# Altium schematic sheet semiflex-1.SchDoc
size A3
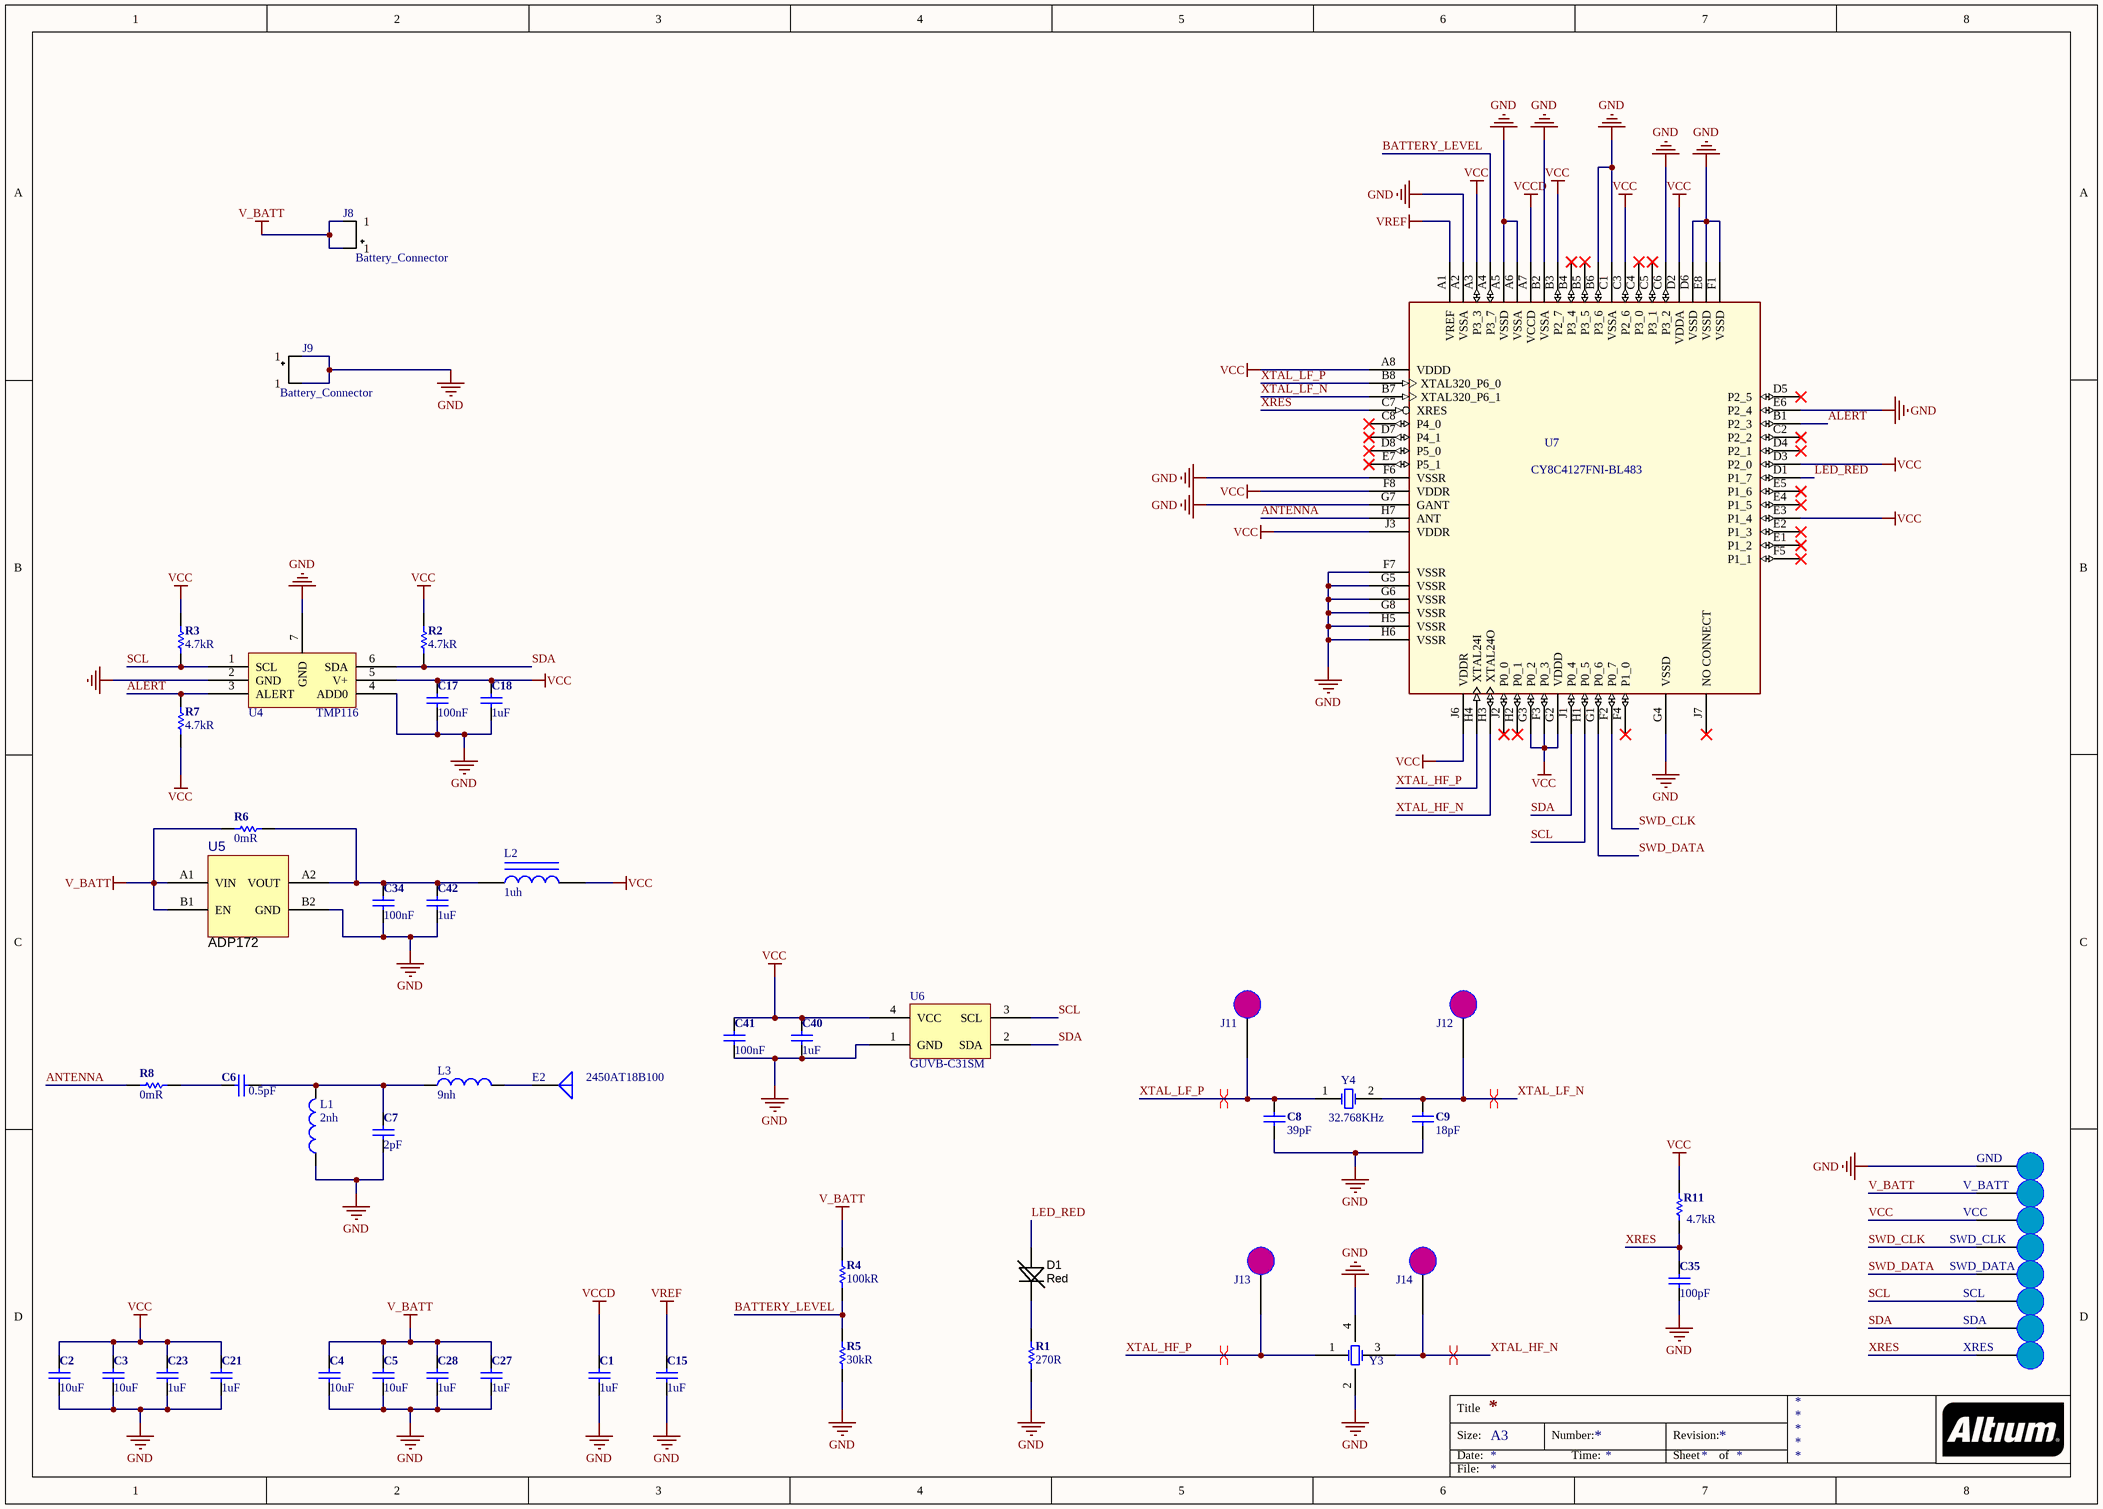
[diagram p0: semiflex-1.SchDoc]

## Parts
C1  1uF  [CAP_0201(0603)_M]
C2  10uF  [CAP_0402(1005)_M]
C3  10uF  [CAP_0402(1005)_M]
C4  10uF  [CAP_0402(1005)_M]
C5  10uF  [CAP_0402(1005)_M]
C6  0.5pF  [CAP_0402(1005)_M]
C7  2pF  [CAP_0402(1005)_M]
C8  39pF  [CAP_0402(1005)_M]
C9  18pF  [CAP_0402(1005)_M]
C15  1uF  [CAP_0201(0603)_M]
C17  100nF  [CAP_0201(0603)_M]
C18  1uF  [CAP_0201(0603)_M]
C21  1uF  [CAP_0201(0603)_M]
C23  1uF  [CAP_0201(0603)_M]
C27  1uF  [CAP_0201(0603)_M]
C28  1uF  [CAP_0201(0603)_M]
C34  100nF  [CAP_0201(0603)_M]
C35  100pF  [CAP_0201(0603)_M]
C40  1uF  [CAP_0201(0603)_M]
C41  100nF  [CAP_0201(0603)_M]
C42  1uF  [CAP_0201(0603)_M]
D1  Red  [LED_0402(1005)]
E2  2450AT18B100  [2450AT18B100]
GND  Probe-Pin Pad  [Pogo-Pin-Pad]  (value not drawn)
J8  Battery_Connector  [Battery_PAD]
J9  Battery_Connector  [Battery_PAD]
J11  Probe-CLOCK  [Pogo-CLOCK-PAD]  (value not drawn)
J12  Probe-CLOCK  [Pogo-CLOCK-PAD]  (value not drawn)
J13  Probe-CLOCK  [Pogo-CLOCK-PAD]  (value not drawn)
J14  Probe-CLOCK  [Pogo-CLOCK-PAD]  (value not drawn)
L1  2nh  [IND_0402(1005)_M]
L2  1uh  [IND_0402(1005)_M]
L3  9nh  [IND_0402(1005)_M]
R1  270R  [RES_0201(0603)_M]
R2  4.7kR  [RES_0201(0603)_M]
R3  4.7kR  [RES_0201(0603)_M]
R4  100kR  [RES_0201(0603)_M]
R5  30kR  [RES_0201(0603)_M]
R6  0mR  [RES_0402(1005)_M]
R7  4.7kR  [RES_0201(0603)_M]
R8  0mR  [RES_0402(1005)_M]
R11  4.7kR  [RES_0201(0603)_M]
SCL  Probe-Pin Pad  [Pogo-Pin-Pad]  (value not drawn)
SDA  Probe-Pin Pad  [Pogo-Pin-Pad]  (value not drawn)
SWD_CLK  Probe-Pin Pad  [Pogo-Pin-Pad]  (value not drawn)
SWD_DATA  Probe-Pin Pad  [Pogo-Pin-Pad]  (value not drawn)
U4  TMP116  [WSON-6]
U5  ADP172  [ADP172]
U6  GUVB-C31SM  [GUVB-C31SM]
U7  CY8C4127FNI-BL483  [WLCSP-68_MOD]
V_BATT  Probe-Pin Pad  [Pogo-Pin-Pad]  (value not drawn)
VCC  Probe-Pin Pad  [Pogo-Pin-Pad]  (value not drawn)
XRES  Probe-Pin Pad  [Pogo-Pin-Pad]  (value not drawn)
Y3  ECX-2236  [ECX-2236]  (value not drawn)
Y4  32.768KHz  [ABS05]

## Nets
GND: C1.2 C2.2 C3.2 C4.2 C5.2 C7.2 C8.2 C9.2 C15.2 C17.2 C18.2 C21.2 C23.2 C27.2 C28.2 C34.2 C35.2 C40.1 C41.1 C42.2 GND.1 J9.1 L1.1 R1.2 R5.2 U4.2(GND) U4.4(ADD0) U4.7(GND) U5.B2(GND) U6.1(GND) U7.A2(VSSA) U7.A5(VSSD) U7.A6(VSSA) U7.B2(VSSA) U7.B6(P3_6) U7.C1(VSSA) U7.C6(P3_2) U7.D6(VSSD) U7.E6(P2_4) U7.E8(VSSD) U7.F1(VSSD) U7.F6(VSSR) U7.F7(VSSR) U7.G4(VSSD) U7.G5(VSSR) U7.G6(VSSR) U7.G7(GANT) U7.G8(VSSR) U7.H5(VSSR) U7.H6(VSSR) Y3.2(GND) Y3.4(GND)
V_BATT: C4.1 C5.1 C27.1 C28.1 J8.1 R4.1 R6.1 U5.A1(VIN) U5.B1(EN) V_BATT.1
VCC: C2.1 C3.1 C17.1 C18.1 C21.1 C23.1 C40.2 C41.2 L2.2 R2.1 R3.1 R7.2 R11.1 U4.5(V+) U6.4(VCC) U7.A3(P3_3) U7.A8(VDDD) U7.B3(P2_7) U7.C3(P2_6) U7.D2(VDDA) U7.D3(P2_0) U7.E3(P1_4) U7.F3(P0_3) U7.F8(VDDR) U7.G2(VDDD) U7.G3(P0_2) U7.J3(VDDR) U7.J6(VDDR) VCC.1
VCCD: C1.1 U7.A7(VCCD)
VREF: C15.1 U7.A1(VREF)
ALERT: R7.1 U4.3(ALERT) U7.B1(P2_3)
ANTENNA: R8.1 U7.H7(ANT)
BATTERY_LEVEL: R4.2 R5.1 U7.A4(P3_7)
LED_RED: D1.A U7.D1(P1_7)
SCL: R3.2 SCL.1 U4.1(SCL) U6.3(SCL) U7.H1(P0_5)
SDA: R2.2 SDA.1 U4.6(SDA) U6.2(SDA) U7.J1(P0_4)
SWD_CLK: SWD_CLK.1 U7.F2(P0_7)
SWD_DATA: SWD_DATA.1 U7.G1(P0_6)
XRES: C35.1 R11.2 U7.C7(XRES) XRES.1
XTAL_HF_N: J14.1 U7.H3(XTAL24O) Y3.3(OSC2)
XTAL_HF_P: J13.1 U7.H4(XTAL24I) Y3.1(OSC1)
XTAL_LF_N: C9.1 J12.1 U7.B7(XTAL320_P6_1) Y4.2(OSC2)
XTAL_LF_P: C8.1 J11.1 U7.B8(XTAL320_P6_0) Y4.1(OSC1)
NetC6_1: C6.1 R8.2
NetC6_2: C6.2 C7.1 L1.2 L3.1
NetC34_1: C34.1 C42.1 L2.1 R6.2 U5.A2(VOUT)
NetD1_K: D1.K R1.1
NetE2_1: E2.1(A) L3.2

Not connected (* = marked no-connect by the designer): U7 B4(P3_4)* B5(P3_5)* C2(P2_2)* C4(P3_0)* C5(P3_1)* C8(P4_0)* D4(P2_1)* D5(P2_5)* D7(P4_1)* D8(P5_0)* E1(P1_2)* E2(P1_3)* E4(P1_5)* E5(P1_6)* E7(P5_1)* F4(P1_0)* F5(P1_1)* H2(P0_1)* J2(P0_0)* J7(NO_CONNECT)*

## Layout directives
differential pair: XTAL_HF_N, XTAL_HF_P, XTAL_LF_N, XTAL_LF_P

## Notes on the sheet
- Title
- Size:
- Date:
- A3
- Number:
- Time:
- Revision:
- Sheet
- of
- File:

## Library data of the parts
C1 C15 C18 C21 C23 C27 C28 C40 C42 = C-0201(0603): ___ OHM ___ mW 0201(0603) SMD; Manufacturer: Murata; Manufacturer Part Number: GRM033C81A105ME05D; Description 1: 1µF 10V Ceramic Capacitor X6S 0201 (0603 Metric) 0.024" L x 0.012" W (0.60mm x 0.30mm); Voltage Rating: 10V; Tolerance: 20%; Dielectric: X6S; Supplier 1: Digi-Key; Supplier Part Number 1: 490-13219-1-ND; Stock 1: 1199738; Pricing 1: 1=0.48, 10=0.333, 100=0.1997, 500=0.1498, 1000=0.1265, 2500=0.1198, 5000=0.1132 (USD); Mount: Surface Mount; Case/Package: 0201; Case Code (Metric): 0603; Case Code (Imperial): 0201; Min Operating Temperature: -55°C; Max Operating Temperature: 105°C; Packaging: Tape and Reel; Capacitance: 1uF; Voltage Rating (DC): 10V; Length: 0.024inch; Width: 0.012inch; Thickness: 0.015inch; ComponentLink1URL: http://search.murata.co.jp/Ceramy/image/img/A01X/partnumbering_e_01.pdf; ComponentLink1Description: http://search.murata.co.jp/Ceramy/image/img/A01X/partnumbering_e_01.pdf
C2-C5 = C-0402(1005): ___ OHM ___ mW 0402(1005) SMD; Manufacturer: Murata; Manufacturer Part Number: GRM155R60J106ME15D; Description 1: 10µF 6.3V Ceramic Capacitor X5R 0402 (1005 Metric) 0.039" L x 0.020" W (1.00mm x 0.50mm); Voltage Rating: 6.3V; Tolerance: 20%; Dielectric: X5R; Supplier 1: Digi-Key; Supplier Part Number 1: 490-13238-1-ND; Stock 1: 427251; Pricing 1: 1=0.29, 10=0.196, 100=0.0994, 500=0.068, 1000=0.0602, 2500=0.0576, 5000=0.0523 (USD); Mount: Surface Mount; Case/Package: 0402; Case Code (Metric): 1005; Case Code (Imperial): 0402; Min Operating Temperature: -55°C; Max Operating Temperature: 85°C; Packaging: Tape and Reel; Capacitance: 10uF; Voltage Rating (DC): 6.3V; Length: 0.039inch; Width: 0.02inch; Thickness: 0.026inch; ComponentLink1URL: http://search.murata.co.jp/Ceramy/image/img/A01X/partnumbering_e_01.pdf; ComponentLink1Description: http://search.murata.co.jp/Ceramy/image/img/A01X/partnumbering_e_01.pdf
C6 = C-0402(1005): ___ OHM ___ mW 0402(1005) SMD; Manufacturer: Murata; Manufacturer Part Number: GJM1555C1HR50WB01D; Description 1: Multilayer Ceramic Capacitors MLCC - SMD/SMT 0402 0.5pF 50Volts C0G +/-0.05pF; Voltage Rating: 50V; Dielectric: C0G; Supplier 1: Digi-Key; Supplier Part Number 1: 490-11250-1-ND; Stock 1: 57275; Pricing 1: 1=0.3, 10=0.205, 100=0.1161, 500=0.082, 1000=0.0717, 2500=0.0683, 5000=0.0632 (USD); Mount: Surface Mount; Case/Package: 0402; Case Code (Metric): 1005; Case Code (Imperial): 0402; Min Operating Temperature: -55°C; Max Operating Temperature: 125°C; Package Quantity: 10000; Capacitance: 0.5pF; Packaging: Tape and Reel; Voltage Rating (DC): 50V; Termination: SMD/SMT; Voltage: 50V; Length: 1mm; Height: 0.5mm; Width: 0.02inch; Thickness: 0.022inch; Depth: 0.5mm; Radiation Hardening: No; Lead Free: Lead Free; ComponentLink1URL: https://datasheet.ciiva.com/169/product-169683.pdf; ComponentLink1Description: https://datasheet.ciiva.com/169/product-169683.pdf
C7 = C-0402(1005): ___ OHM ___ mW 0402(1005) SMD; Manufacturer: Murata; Manufacturer Part Number: GJM1555C1H2R0BB01D; Description 1: Multilayer Ceramic Capacitors MLCC - SMD/SMT 0402 2.0pF 50Volts C0G +/-0.1pF; Voltage Rating: 50V; Dielectric: C0G; Supplier 1: Digi-Key; Supplier Part Number 1: 490-8091-1-ND; Stock 1: 103779; Pricing 1: 1=0.19, 10=0.13, 100=0.0659, 500=0.0451, 1000=0.0399, 2500=0.0381, 5000=0.0347 (USD); Mount: Surface Mount; Case/Package: 0402; Number of Pins: 2; Case Code (Metric): 1005; Case Code (Imperial): 0402; Min Operating Temperature: -55°C; Max Operating Temperature: 125°C; Package Quantity: 1; Packaging: Tape and Reel; Capacitance: 2pF; Voltage Rating (DC): 50V; Termination: SMD/SMT; Length: 1mm; Height: 0.5mm; Width: 0.5mm; Thickness: 0.022inch; Lead Pitch: 0.3mm; Depth: 0.5mm; Radiation Hardening: No; REACH SVHC: No SVHC; Lead Free: Lead Free; ComponentLink1URL: https://datasheet.ciiva.com/5694/1700193-5694978.pdf; ComponentLink1Description: https://datasheet.ciiva.com/5694/1700193-5694978.pdf; ComponentLink2URL: https://datasheet.ciiva.com/16440/l0005e-16440476.pdf; ComponentLink2Description: https://datasheet.ciiva.com/16440/l0005e-16440476.pdf; ComponentLink3URL: https://datasheet.ciiva.com/17453/product-17453487.pdf; ComponentLink3Description: https://datasheet.ciiva.com/17453/product-17453487.pdf
C8 = C-0402(1005): ___ OHM ___ mW 0402(1005) SMD; Manufacturer: KEMET; Manufacturer Part Number: CBR04C390F5GAC; Description 1: Multilayer Ceramic Capacitors MLCC - SMD/SMT 39pF 50volts 1%; Dielectric: C0G; Voltage Rating (DC): 50V; Tolerance: 1%; Supplier 1: Digi-Key; Supplier Part Number 1: 399-16083-1-ND; Stock 1: 6320; Pricing 1: 1=0.54, 10=0.374, 100=0.2247, 500=0.1685, 1000=0.1423, 2500=0.1348, 5000=0.1273 (USD); Case/Package: 0402; Weight: 2.3E-05oz; Case Code (Imperial): 0402; Case Code (Metric): 1005; Min Operating Temperature: -55°C; Max Operating Temperature: 125°C; Capacitance: 39pF; Packaging: Tape and Reel; Termination: SMD/SMT; Package Quantity: 10000; Length: 1mm; Height: 0.5mm; Width: 0.5mm; ComponentLink1URL: http://www.mouser.com/ds/2/212/KEM_C1030_CBR_SMD-346920.pdf; ComponentLink1Description: http://www.mouser.com/ds/2/212/KEM_C1030_CBR_SMD-346920.pdf
C9 = C-0402(1005): ___ OHM ___ mW 0402(1005) SMD; Manufacturer: Murata; Manufacturer Part Number: GJM1555C1H180FB01D; Description 1: Multilayer Ceramic Capacitors MLCC - SMD/SMT 0402 18pF 50Volts C0G 1%; Tolerance: 1%; Voltage Rating: 50V; Dielectric: C0G; Supplier 1: Digi-Key; Supplier Part Number 1: 490-11192-1-ND; Stock 1: 51032; Pricing 1: 1=0.24, 10=0.162, 100=0.0822, 500=0.0563, 1000=0.0498, 2500=0.0476, 5000=0.0433 (USD); Mount: Surface Mount; Case/Package: 0402; Case Code (Imperial): 0402; Case Code (Metric): 1005; Min Operating Temperature: -55°C; Max Operating Temperature: 125°C; Capacitance: 18pF; Package Quantity: 10000; Packaging: Tape and Reel; Voltage Rating (DC): 50V; Termination: SMD/SMT; Length: 1mm; Height: 0.5mm; Width: 0.02inch; Thickness: 0.022inch; Depth: 0.5mm; Radiation Hardening: No; Lead Free: Lead Free; ComponentLink1URL: https://datasheet.ciiva.com/11607/c02e-11607834.pdf; ComponentLink1Description: https://datasheet.ciiva.com/11607/c02e-11607834.pdf
C17 C34 C41 = C-0201(0603): ___ OHM ___ mW 0201(0603) SMD; Manufacturer: Murata; Manufacturer Part Number: GRM033R61A104ME15D; Description 1: Cap Ceramic 0.1uF 10V X5R 20% SMD 0201 85C Paper T/R; Voltage Rating: 10V; Tolerance: 20%; Dielectric: X5R; Supplier 1: Digi-Key; Supplier Part Number 1: 490-5405-1-ND; Stock 1: 5696; Pricing 1: 1=0.1, 10=0.021, 100=0.0092, 500=0.0066, 1000=0.0052, 2500=0.0047, 5000=0.0043 (USD); Mount: Surface Mount; Case/Package: 0201; Case Code (Metric): 0603; Case Code (Imperial): 0201; Min Operating Temperature: -55°C; Max Operating Temperature: 85°C; Capacitance: 100nF; Packaging: Tape and Reel; Package Quantity: 10; Voltage Rating (DC): 10V; Length: 0.024inch; Width: 0.012inch; Thickness: 0.013inch; Depth: 0.3mm; Lead Free: Lead Free; ComponentLink1URL: https://datasheet.ciiva.com/131/partnumbering-e-01-131478.pdf; ComponentLink1Description: https://datasheet.ciiva.com/131/partnumbering-e-01-131478.pdf; ComponentLink2URL: https://datasheet.ciiva.com/131/partnumbering-e-01-131479.pdf; ComponentLink2Description: https://datasheet.ciiva.com/131/partnumbering-e-01-131479.pdf
C35 = C-0201(0603): ___ OHM ___ mW 0201(0603) SMD; Manufacturer: Murata; Manufacturer Part Number: GRM033R71C101KA01D; Description 1: Multilayer Ceramic Capacitors MLCC - SMD/SMT 100pF 16 volts 10%; Voltage Rating: 16V; Tolerance: 10%; Dielectric: X7R; Supplier 1: Digi-Key; Supplier Part Number 1: 490-6146-1-ND; Stock 1: 195000; Pricing 1: 1=0.1, 10=0.033, 100=0.0148, 500=0.0106, 1000=0.0083, 2500=0.0076, 5000=0.007 (USD); Mount: Surface Mount; Case/Package: 0201; Case Code (Metric): 0603; Case Code (Imperial): 0201; Min Operating Temperature: -55°C; Max Operating Temperature: 125°C; Capacitance: 100pF; Packaging: Tape and Reel; Voltage Rating (DC): 16V; Package Quantity: 15000; Termination: SMD/SMT; Length: 0.6mm; Height: 0.3mm; Width: 0.012inch; Thickness: 0.013inch; Depth: 0.3mm; Radiation Hardening: No; Lead Free: Lead Free; ComponentLink1URL: https://datasheet.ciiva.com/11605/product-11605537.pdf; ComponentLink1Description: https://datasheet.ciiva.com/11605/product-11605537.pdf; ComponentLink2URL: https://datasheet.ciiva.com/6263/partnumbering-e-01-6263654.pdf; ComponentLink2Description: https://datasheet.ciiva.com/6263/partnumbering-e-01-6263654.pdf; ComponentLink3URL: https://datasheet.ciiva.com/6263/partnumbering-e-01-6263658.pdf; ComponentLink3Description: https://datasheet.ciiva.com/6263/partnumbering-e-01-6263658.pdf; ComponentLink4URL: https://datasheet.ciiva.com/18184/getdatasheetpartid-254442-18184076.pdf; ComponentLink4Description: https://datasheet.ciiva.com/18184/getdatasheetpartid-254442-18184076.pdf
D1 = LED_0402(1005): LED, 0402(1005) SMD; Manufacturer: Kingbright; Manufacturer Part Number: APHHS1005SURCK; Description 1: LED 1X0.5MM 630NM RD WTR CLR SMD; Lens Colour: Clear; Forward Current: 20mA; Forward Voltage: 1.95V; Luminous Intensity: 220mcd; Viewing Angle: 120°; Wavelength: 635nm; Lens Style: Flat,Clear; Dominant Wavelength: 630nm; Number of LEDs: 1; Supplier 1: Digi-Key; Supplier Part Number 1: 754-1104-1-ND; Stock 1: 195639; Pricing 1: 1=0.44, 10=0.318, 25=0.2596, 100=0.2077, 250=0.1752, 500=0.1493, 1000=0.1168 (USD); Mount: Surface Mount; Case/Package: 0402; Number of Pins: 2; Colour: Red; Case Code (Metric): 1005; Case Code (Imperial): 0402; Min Operating Temperature: -40°C; Max Operating Temperature: 85°C; Packaging: Tape and Reel; Package Quantity: 2000; Illumination Colour: Red; Test Current: 20mA; Length: 1mm; Height: 0.6mm; Width: 0.5mm; Lead Free: Lead Free; ComponentLink1URL: https://datasheet.ciiva.com/14603/70062833-14603899.pdf; ComponentLink1Description: https://datasheet.ciiva.com/14603/70062833-14603899.pdf; ComponentLink2URL: https://datasheet.ciiva.com/2114/aphhs1005surck-2114140.pdf; ComponentLink2Description: https://datasheet.ciiva.com/2114/aphhs1005surck-2114140.pdf; ComponentLink3URL: https://datasheet.ciiva.com/4689/aphhs1005surck-32322-4689068.pdf; ComponentLink3Description: https://datasheet.ciiva.com/4689/aphhs1005surck-32322-4689068.pdf; ComponentLink4URL: https://datasheet.ciiva.com/2114/aphhs1005surck-2114141.pdf; ComponentLink4Description: https://datasheet.ciiva.com/2114/aphhs1005surck-2114141.pdf; ComponentLink5URL: https://datasheet.ciiva.com/2114/aphhs1005surck-2114142.pdf; ComponentLink5Description: https://datasheet.ciiva.com/2114/aphhs1005surck-2114142.pdf
E2 = 2450AT18B100: 2.4 GHz BLE Antenna; Manufacturer: Johanson; Manufacturer Part Number: 2450AT18B100E; Description 1: JOHANSON TECHNOLOGY         2450AT18B100E             ANTENNA, CERAMIC, 2.45GHZ; Impedance: 50R; Bandwidth: 100MHz; Power Rating: 3W; Frequency: 2.45GHz; Number of Bands: 1; Return Loss: -9.5dB; Max Frequency: 2.5GHz; Gain: -0.5dB; Supplier 1: Digi-Key; Supplier Part Number 1: 712-1006-1-ND; Stock 1: 187598; Pricing 1: 1=0.62, 10=0.541, 25=0.4788, 100=0.4172, 250=0.3631, 500=0.309, 1000=0.2472 (USD); Mount: Surface Mount; Case/Package: CSMD; Contact Plating: Tin; Packaging: Tape and Reel; Package Quantity: 1; Max Power Dissipation: 3W; Termination: Solder; Length: 3.2mm; Height: 0.051inch; Width: 1.6mm; REACH SVHC: No SVHC; ComponentLink1URL: https://datasheet.ciiva.com/1124/1318299-1124918.pdf; ComponentLink1Description: https://datasheet.ciiva.com/1124/1318299-1124918.pdf; ComponentLink2URL: https://datasheet.ciiva.com/24025/antenna-2450at18b100-242422-24025839.pdf; ComponentLink2Description: https://datasheet.ciiva.com/24025/antenna-2450at18b100-242422-24025839.pdf
L1 = I-0402(1005): Manufacturer: Abracon; Manufacturer Part Number: AISC-0402-2N0J-T; Description 1: 2nH Unshielded Wirewound Inductor 1.04A 70 mOhm Max 0402 (1005 Metric); Core Material: Ceramic; Current Rating: 1.04A; Tolerance: 5%; Shielding: Unshielded; Q Factor: 16; Self Resonant Frequency: 11.1GHz; DC Resistance (DCR): 70mR; Test Frequency: 250MHz; Supplier 1: Digi-Key; Supplier Part Number 1: 535-10424-6-ND; Stock 1: 5165; Pricing 1: 1=0.33, 10=0.297, 25=0.264, 50=0.231, 100=0.2145, 500=0.1881, 750=0.1716, 1000=0.1518 (USD); Mount: Surface Mount; Case/Package: 0402; Number of Pins: 2; Case Code (Metric): 1005; Case Code (Imperial): 0402; Min Operating Temperature: -40°C; Max Operating Temperature: 125°C; Package Quantity: 10000; Packaging: Tape and Reel; Composition: Wirewound,Ceramic; Inductance: 2nh; Max DC Current: 1.04A; Termination: SMD/SMT; DC Current: 1.04A; Military Standard: Not; Length: 1.19mm; Height: 0.66mm; Width: 0.025inch; Height - Seated (Max): 0.026inch; Depth: 0.64mm; Radiation Hardening: No; ComponentLink1URL: https://datasheet.ciiva.com/1054/aisc-0402-1054032.pdf; ComponentLink1Description: https://datasheet.ciiva.com/1054/aisc-0402-1054032.pdf; ComponentLink2URL: https://datasheet.ciiva.com/26928/getdatasheetpartid-762366-26928064.pdf; ComponentLink2Description: https://datasheet.ciiva.com/26928/getdatasheetpartid-762366-26928064.pdf; ComponentLink3URL: https://datasheet.ciiva.com/11140/aisc-0402-11140262.pdf; ComponentLink3Description: https://datasheet.ciiva.com/11140/aisc-0402-11140262.pdf; ComponentLink4URL: https://datasheet.ciiva.com/1054/aisc-0402-1054030.pdf; ComponentLink4Description: https://datasheet.ciiva.com/1054/aisc-0402-1054030.pdf; ComponentLink5URL: https://datasheet.ciiva.com/1054/aisc-0402-1054031.pdf; ComponentLink5Description: https://datasheet.ciiva.com/1054/aisc-0402-1054031.pdf
L2 = Inductor Iron: Magnetic-Core Inductor; Manufacturer: TDK; Manufacturer Part Number: MLZ1005M1R0WT000; Description 1: FIXED IND 1UH 450MA 350 MOHM SMD; Core Material: Ferrite; Tolerance: 20%; Current Rating: 450mA; Saturation Current: 100mA; Shielding: Shielded; DC Resistance (DCR): 455mR; Self Resonant Frequency: 170MHz; Test Frequency: 2MHz; Supplier 1: Digi-Key; Supplier Part Number 1: 445-6379-1-ND; Stock 1: 22743; Pricing 1: 1=0.29, 10=0.258, 100=0.1771, 500=0.1513, 1000=0.1159, 2500=0.1095 (USD); Mount: Surface Mount; Case/Package: 0402; Case Code (Metric): 1005; Case Code (Imperial): 0402; Min Operating Temperature: -55°C; Max Operating Temperature: 125°C; Package Quantity: 10000; Packaging: Tape and Reel; Inductance: 1uh; Length: 0.039inch; Width: 0.02inch; Height - Seated (Max): 0.022inch; ComponentLink1URL: https://datasheet.ciiva.com/29699/inductor-commercial-decoupling-mlz-en-29699052.pdf; ComponentLink1Description: https://datasheet.ciiva.com/29699/inductor-commercial-decoupling-mlz-en-29699052.pdf; ComponentLink2URL: https://datasheet.ciiva.com/29699/inductor-commercial-decoupling-mlz-en-29699053.pdf; ComponentLink2Description: https://datasheet.ciiva.com/29699/inductor-commercial-decoupling-mlz-en-29699053.pdf
L3 = I-0402(1005): Manufacturer: Murata; Manufacturer Part Number: LQW15AN9N0G80D; Description 1: 9nH Unshielded Wirewound Inductor 1.42A 70 mOhm Max 0402 (1005 Metric); Current Rating: 1.42A; Shielding: Unshielded; DC Resistance (DCR): 70mR; Self Resonant Frequency: 6.5GHz; Test Frequency: 100MHz; Tolerance: 2%; Supplier 1: Digi-Key; Supplier Part Number 1: 490-14715-1-ND; Stock 1: 3213; Pricing 1: 1=0.25, 10=0.221, 100=0.1518, 500=0.1297, 1000=0.0994, 2500=0.0938 (USD); Mount: Surface Mount; Case/Package: 0402; Min Operating Temperature: -55°C; Max Operating Temperature: 125°C; Packaging: Tape and Reel; Composition: Wirewound; Inductance: 9nh; Length: 0.039inch; Width: 0.024inch; Height - Seated (Max): 0.024inch
R1 = R-0201(0603): ___ OHM ___ mW 0201(0603) SMD; Manufacturer: Yageo; Manufacturer Part Number: RC0201JR-07270RL; Description 1: Res Thick Film 0201 270 Ohm 5% 0.05W(1/20W) ±200ppm/C Molded SMD Paper T/R; Tolerance: 5%; Power Rating: 50mW; Temperature Coefficient: 200ppm/°C; Supplier 1: Digi-Key; Supplier Part Number 1: 311-270NCT-ND; Stock 1: 26098; Pricing 1: 1=0.1, 10=0.043, 100=0.0174, 1000=0.0078, 2500=0.0068, 5000=0.0056 (USD); Case/Package: 0201; Contact Plating: Tin,Matte; Min Operating Temperature: -55°C; Max Operating Temperature: 125°C; Resistance: 270R; Packaging: Tape and Reel; Composition: Thick Film; Military Standard: Not; Length: 0.6mm; Depth: 0.3mm; Radiation Hardening: No; Lead Free: Lead Free; ComponentLink1URL: https://datasheet.ciiva.com/16855/pyu-rc0201-51-rohs-l-8-16855339.pdf; ComponentLink1Description: https://datasheet.ciiva.com/16855/pyu-rc0201-51-rohs-l-8-16855339.pdf; ComponentLink2URL: https://datasheet.ciiva.com/28392/pyu-rc0201-51-rohs-l-8-28392445.pdf; ComponentLink2Description: https://datasheet.ciiva.com/28392/pyu-rc0201-51-rohs-l-8-28392445.pdf
R2 R3 R7 R11 = R-0201(0603): ___ OHM ___ mW 0201(0603) SMD; Manufacturer: Samsung; Manufacturer Part Number: RC0603F472CS; Description 1: RES SMD 4.7K OHM 1% 1/20W 0201; Tolerance: 1%; Max Power Dissipation: 50mW; Temperature Coefficient: 250ppm/°C; Voltage Rating (DC): 25V; Supplier 1: Digi-Key; Supplier Part Number 1: 1276-3651-1-ND; Stock 1: 51051; Pricing 1: 1=0.1, 10=0.021, 100=0.0086, 1000=0.0039, 2500=0.0033, 5000=0.0028 (USD); Case/Package: 0201; Case Code (Metric): 0603; Case Code (Imperial): 0201; Contact Plating: Tin; Min Operating Temperature: -55°C; Max Operating Temperature: 125°C; Packaging: Tape and Reel; Resistance: 4.7kR; Composition: Thick Film; Package Quantity: 1; Number of Terminations: 2; Length: 0.024inch; Height: 0.01inch; Width: 0.012inch; Radiation Hardening: No; Lead Free: Lead Free; ComponentLink1URL: http://components.arrow.com/part/dataview/52317213S9968065N4139; ComponentLink1Description: http://components.arrow.com/part/dataview/52317213S9968065N4139; ComponentLink2URL: http://www.samsungsem.com/kr/support/library/product-catalog/__icsFiles/afieldfile/2015/09/22/CHIP_RESISTOR_2015.pdf; ComponentLink2Description: http://www.samsungsem.com/kr/support/library/product-catalog/__icsFiles/afieldfile/2015/09/22/CHIP_RESISTOR_2015.pdf; ComponentLink3URL: http://www.samsungsem.com/servlet/FileDownload?type=spec&file=RC0603F100CS.pdf; ComponentLink3Description: http://www.samsungsem.com/servlet/FileDownload?type=spec&file=RC0603F100CS.pdf
R4 = R-0201(0603): ___ OHM ___ mW 0201(0603) SMD; Manufacturer: Yageo; Manufacturer Part Number: RC0201FR-07100KL; Description 1: RES SMD 100K OHM 1% 1/20W 0201; Tolerance: 1%; Power Rating: 50mW; Voltage Rating: 25V; Temperature Coefficient: 200ppm/°C; Supplier 1: Digi-Key; Supplier Part Number 1: 311-100KMDKR-ND; Stock 1: 5575803; Pricing 1: 1=0.1, 10=0.057, 100=0.0232, 1000=0.0104, 2500=0.009, 5000=0.0075 (USD); Case/Package: 0201; Number of Pins: 2; Case Code (Imperial): 0201; Case Code (Metric): 0603; Contact Plating: Tin,Matte; Min Operating Temperature: -55°C; Max Operating Temperature: 125°C; Resistance: 100kR; Packaging: Tape and Reel; Package Quantity: 10000; Termination: SMD/SMT; Composition: Thick Film; Number of Terminations: 2; Military Standard: Not; Max Power Dissipation: 50mW; Voltage Rating (DC): 25V; Length: 0.024inch; Height: 0.01inch; Width: 0.012inch; Depth: 0.3mm; REACH SVHC: No SVHC; Lead Free: Lead Free; ComponentLink1URL: https://datasheet.ciiva.com/7660/1421516-7660806.pdf; ComponentLink1Description: https://datasheet.ciiva.com/7660/1421516-7660806.pdf; ComponentLink2URL: https://datasheet.ciiva.com/2493/pyu-r-int-thick-7-2493769.pdf; ComponentLink2Description: https://datasheet.ciiva.com/2493/pyu-r-int-thick-7-2493769.pdf; ComponentLink3URL: https://datasheet.ciiva.com/2493/pyu-r-int-thick-7-2493770.pdf; ComponentLink3Description: https://datasheet.ciiva.com/2493/pyu-r-int-thick-7-2493770.pdf; ComponentLink4URL: https://datasheet.ciiva.com/26829/getdatasheetpartid-420441-26829850.pdf; ComponentLink4Description: https://datasheet.ciiva.com/26829/getdatasheetpartid-420441-26829850.pdf; ComponentLink5URL: https://datasheet.ciiva.com/46391/1421516-46391338.pdf; ComponentLink5Description: https://datasheet.ciiva.com/46391/1421516-46391338.pdf; ComponentLink6URL: https://datasheet.ciiva.com/2493/pyu-r-int-thick-7-2493771.pdf; ComponentLink6Description: https://datasheet.ciiva.com/2493/pyu-r-int-thick-7-2493771.pdf; ComponentLink7URL: https://datasheet.ciiva.com/16855/pyu-rc0201-51-rohs-l-8-16855774.pdf; ComponentLink7Description: https://datasheet.ciiva.com/16855/pyu-rc0201-51-rohs-l-8-16855774.pdf; ComponentLink8URL: https://datasheet.ciiva.com/22698/1563626-22698495.pdf; ComponentLink8Description: https://datasheet.ciiva.com/22698/1563626-22698495.pdf
R5 = R-0201(0603): ___ OHM ___ mW 0201(0603) SMD; Manufacturer: Yageo; Manufacturer Part Number: RC0201FR-0730KL; Description 1: Thick Film Resistors - SMD 30K OHM 1%; Tolerance: 1%; Power Rating: 50mW; Voltage Rating: 25V; Temperature Coefficient: 200ppm/°C; Supplier 1: Digi-Key; Supplier Part Number 1: YAG2281CT-ND; Stock 1: 45325; Pricing 1: 1=0.1, 10=0.046, 100=0.0187, 1000=0.0084, 2500=0.0073, 5000=0.006 (USD); Case/Package: 0201; Case Code (Metric): 0603; Case Code (Imperial): 0201; Min Operating Temperature: -55°C; Max Operating Temperature: 125°C; Package Quantity: 10000; Packaging: Tape and Reel; Resistance: 30kR; Composition: Thick Film; Number of Terminations: 2; Termination: SMD/SMT; Military Standard: Not; Max Power Dissipation: 50mW; Length: 0.6mm; Height: 0.01inch; Width: 0.012inch; Depth: 0.3mm; Lead Free: Lead Free; ComponentLink1URL: http://components.arrow.com/part/dataview/0323_03297116; ComponentLink1Description: http://components.arrow.com/part/dataview/0323_03297116; ComponentLink2URL: http://www.yageo.com.tw/exep/pages/download/literatures/PYu-R_INT-thick_7.pdf; ComponentLink2Description: http://www.yageo.com.tw/exep/pages/download/literatures/PYu-R_INT-thick_7.pdf; ComponentLink3URL: http://www.yageo.com/documents/recent/PYu-RC_Group_51_RoHS_L_8.pdf; ComponentLink3Description: http://www.yageo.com/documents/recent/PYu-RC_Group_51_RoHS_L_8.pdf; ComponentLink4URL: http://www.mouser.com/ds/2/447/RC0201-559633.pdf; ComponentLink4Description: http://www.mouser.com/ds/2/447/RC0201-559633.pdf
R6 R8 = R-0402(1005): ___ OHM ___ mW 0402(1005) SMD; Manufacturer: Panasonic; Manufacturer Part Number: ERJ-2GE0R00X; Description 1: Res Thick Film 0402 0 Ohm Molded SMD Automotive T/R; Power Rating: 100mW; Voltage Rating: 50V; Tolerance: 5%; Temperature Coefficient: 600ppm/°C; Supplier 1: Digi-Key; Supplier Part Number 1: P0.0JCT-ND; Stock 1: 31438214; Pricing 1: 1=0.1, 10=0.028, 25=0.0204, 50=0.0154, 100=0.0114, 250=0.0087, 500=0.007, 1000=0.0051, 5000=0.0037 (USD); Mount: Surface Mount; Case/Package: 0402; Case Code (Metric): 1005; Case Code (Imperial): 0402; Contact Plating: Tin; Min Operating Temperature: -55°C; Max Operating Temperature: 155°C; Resistance: 0mR; Packaging: Tape and Reel; Package Quantity: 1; Composition: Thick Film; Number of Terminations: 2; Termination: SMD/SMT; Military Standard: Not; Max Power Dissipation: 100mW; Voltage Rating (DC): 50V; Length: 1mm; Height: 0.35mm; Width: 0.02inch; Depth: 0.5mm; Radiation Hardening: No; REACH SVHC: No SVHC; Lead Free: Lead Free; ComponentLink1URL: https://datasheet.ciiva.com/48531/aoa0000ce1-48531077.pdf; ComponentLink1Description: https://datasheet.ciiva.com/48531/aoa0000ce1-48531077.pdf; ComponentLink2URL: https://datasheet.ciiva.com/16783/70260739-16783734.pdf; ComponentLink2Description: https://datasheet.ciiva.com/16783/70260739-16783734.pdf; ComponentLink3URL: https://datasheet.ciiva.com/11821/0900766b80f806dd-11821176.pdf; ComponentLink3Description: https://datasheet.ciiva.com/11821/0900766b80f806dd-11821176.pdf; ComponentLink4URL: https://datasheet.ciiva.com/17215/aoa0000ce1-17215386.pdf; ComponentLink4Description: https://datasheet.ciiva.com/17215/aoa0000ce1-17215386.pdf; ComponentLink5URL: https://datasheet.ciiva.com/43460/1678796-43460347.pdf; ComponentLink5Description: https://datasheet.ciiva.com/43460/1678796-43460347.pdf; ComponentLink6URL: https://datasheet.ciiva.com/5959/1678796-5959692.pdf; ComponentLink6Description: https://datasheet.ciiva.com/5959/1678796-5959692.pdf; ComponentLink7URL: https://datasheet.ciiva.com/30097/4aoa0000ce1-30097116.pdf; ComponentLink7Description: https://datasheet.ciiva.com/30097/4aoa0000ce1-30097116.pdf; ComponentLink8URL: https://datasheet.ciiva.com/28695/1678796-28695758.pdf; ComponentLink8Description: https://datasheet.ciiva.com/28695/1678796-28695758.pdf; ComponentLink9URL: https://datasheet.ciiva.com/46389/1678796-46389518.pdf; ComponentLink9Description: https://datasheet.ciiva.com/46389/1678796-46389518.pdf; ComponentLink10URL: https://datasheet.ciiva.com/16778/70260739-16778335.pdf; ComponentLink10Description: https://datasheet.ciiva.com/16778/70260739-16778335.pdf
U4 = TMP116: TI Digital I2C Temperature Sensor; Manufacturer: Texas Instruments; Manufacturer Part Number: TMP116AIDRVT; Interface: I2C,SMBus,2-Wire; Supplier 1: Digi-Key; Supplier Part Number 1: 296-46944-1-ND; Stock 1: 995; Pricing 1: 1=4.01, 10=3.599, 100=2.9485 (USD); Min Operating Temperature: -55°C; Max Operating Temperature: 150°C
U5 = ADP172: 3V LDO; Manufacturer: Analog Devices; Manufacturer Part Number: ADP172ACBZ-3.0-R7; Description 1: Linear Voltage Regulator IC Positive Fixed 1 Output 3V 300mA 4-WLCSP (0.95x1.03); Dropout Voltage: 50mV; Number of Outputs: 1; Min Input Voltage: 1.6V; Max Input Voltage: 3.6V; Max Output Current: 300mA; Min Current Limit: 400mA; Polarity: Positive; Nominal Supply Current: 23uA; Quiescent Current: 60uA; Power Supply Rejection Ratio (PSRR): 73dB; Max Supply Current: 170uA; Min Output Voltage: 800mV; Supplier 1: Digi-Key; Supplier Part Number 1: ADP172ACBZ-3.0-R7CT-ND; Stock 1: 438; Pricing 1: 1=1.13, 10=1.013, 100=0.7896, 500=0.6523, 1000=0.515 (USD); Mount: Surface Mount; Number of Pins: 4; Contact Plating: Copper,Tin,Silver; Min Operating Temperature: -40°C; Max Operating Temperature: 125°C; Package Quantity: 3000; Packaging: Tape and Reel; Output Voltage: 3V; Output Current: 300mA; Number of Regulators: 1; Operating Supply Current: 23uA; Max Output Voltage: 3V; Radiation Hardening: No; Lead Free: Contains Lead; ComponentLink1URL: https://datasheet.ciiva.com/2056/adp172-2056690.pdf; ComponentLink1Description: https://datasheet.ciiva.com/2056/adp172-2056690.pdf; ComponentLink2URL: https://datasheet.ciiva.com/2056/adp172-2056691.pdf; ComponentLink2Description: https://datasheet.ciiva.com/2056/adp172-2056691.pdf; ComponentLink3URL: https://datasheet.ciiva.com/2056/adp172-2056692.pdf; ComponentLink3Description: https://datasheet.ciiva.com/2056/adp172-2056692.pdf; ComponentLink4URL: https://datasheet.ciiva.com/3224/adp172-3224693.pdf; ComponentLink4Description: https://datasheet.ciiva.com/3224/adp172-3224693.pdf; ComponentLink5URL: https://datasheet.ciiva.com/17365/adp172-17365245.pdf; ComponentLink5Description: https://datasheet.ciiva.com/17365/adp172-17365245.pdf; ComponentLink6URL: https://datasheet.ciiva.com/48694/001251525-da-01-en-ic-reg-ldo-adp172acbz-3-0-r7-wlcsp-4-adi-48694412.pdf; ComponentLink6Description: https://datasheet.ciiva.com/48694/001251525-da-01-en-ic-reg-ldo-adp172acbz-3-0-r7-wlcsp-4-adi-48694412.pdf
U7 = CY8C4127FNI-BL483: PSOC 4 CYBLE; Manufacturer: Cypress; Manufacturer Part Number: CY8C4247FNI-BL483T; RAM Size: 16KB; Interface: I2C,SPI,I2S,IrDA,SSP,UART,USART,LIN; Number of I/Os: 36; Number of Timers/Counters: 4; Frequency: 48MHz; Oscillator Type: Internal; Data Bus Width: 32b; Watchdog Timer: Yes; Memory Type: FLASH; Memory Size: 128KB; Peripherals: Brown-out Detect/Reset,POR,PWM,WDT,LVD,LCD; Min Supply Voltage: 1.71V; Max Supply Voltage: 5.5V; Core Architecture: ARM; Supplier 1: Digi-Key; Supplier Part Number 1: 428-4490-ND; Stock 1: 250; Pricing 1: 1=7.05, 10=6.345, 25=5.7812, 100=5.217, 250=4.794, 500=4.371, 1000=3.807, 2500=3.666 (USD); Mount: Surface Mount; Contact Plating: Copper,Tin,Silver; Min Operating Temperature: -40°C; Max Operating Temperature: 85°C; Packaging: Tape and Reel; Number of Programmable I/O: 36; Max Frequency: 48MHz; Package Quantity: 2000; Lead Free: Lead Free; ComponentLink1URL: http://www.cypress.com/?docID=50617; ComponentLink1Description: http://www.cypress.com/?docID=50617; ComponentLink2URL: http://www.cypress.com/file/137466/download; ComponentLink2Description: http://www.cypress.com/file/137466/download
Y3 = ECX-2236: 24 MHz Crystal; Manufacturer: ECS International; Manufacturer Part Number: ECS-240-8-36CKM-TR; Description 1: Crystals 24MHz 10ppm; ESR (Equivalent Series Resistance): 60R; Frequency: 24MHz; Load Capacitance: 8pF; Frequency Stability: 10ppm; Supplier 1: Digi-Key; Supplier Part Number 1: XC1557CT-ND; Stock 1: 30313; Pricing 1: 1=1.12, 10=0.987, 50=0.9224, 100=0.8151, 500=0.7722 (USD); Mount: Surface Mount; Case/Package: SMD/SMT; Min Operating Temperature: -20°C; Max Operating Temperature: 70°C; Package Quantity: 1000; Packaging: Tape and Reel; Frequency Tolerance: 10ppm; Tolerance: 10ppm; Termination: SMD/SMT; Length: 0.098inch; Height: 0.026inch; Width: 0.079inch; ComponentLink1URL: http://www.ecsxtal.com/store/pdf/partnumber4.pdf; ComponentLink1Description: http://www.ecsxtal.com/store/pdf/partnumber4.pdf; ComponentLink2URL: http://www.mouser.com/ds/2/122/ECX-2236-15751.pdf; ComponentLink2Description: http://www.mouser.com/ds/2/122/ECX-2236-15751.pdf
Y4 = ABS05: Crystal Oscillator; Manufacturer: Abracon; Manufacturer Part Number: ABS05-32.768KHZ-T; Description 1: 32.768kHz ±20ppm Crystal 12.5pF 90 kOhm -40°C ~ 85°C  Surface Mount 2-SMD; Frequency Tolerance: 20ppm; Load Capacitance: 12.5pF; ESR (Equivalent Series Resistance): 90kR; Supplier 1: Digi-Key; Supplier Part Number 1: 535-11899-1-ND; Stock 1: 92285; Pricing 1: 1=1.03, 10=0.911, 50=0.8514, 100=0.7524, 500=0.7128, 1000=0.594 (USD); Mount: Surface Mount; Case/Package: SMD/SMT; Number of Pins: 2; Min Operating Temperature: -40°C; Max Operating Temperature: 85°C; Packaging: Tape and Reel; Package Quantity: 3000; Frequency: 32.768kHz; Tolerance: 20ppm; Termination: SMD/SMT; Series Resistance: 90kR; Length: 1.6mm; Height: 0.02inch; Width: 0.039inch; Depth: 1mm; Radiation Hardening: No; REACH SVHC: No SVHC; Lead Free: Lead Free; ComponentLink1URL: https://datasheet.ciiva.com/23810/abs05-23810480.pdf; ComponentLink1Description: https://datasheet.ciiva.com/23810/abs05-23810480.pdf; ComponentLink2URL: https://datasheet.ciiva.com/6728/abs05-6728949.pdf; ComponentLink2Description: https://datasheet.ciiva.com/6728/abs05-6728949.pdf; ComponentLink3URL: https://datasheet.ciiva.com/6728/abs05-6728950.pdf; ComponentLink3Description: https://datasheet.ciiva.com/6728/abs05-6728950.pdf; ComponentLink4URL: https://datasheet.ciiva.com/16411/abs05-16411149.pdf; ComponentLink4Description: https://datasheet.ciiva.com/16411/abs05-16411149.pdf